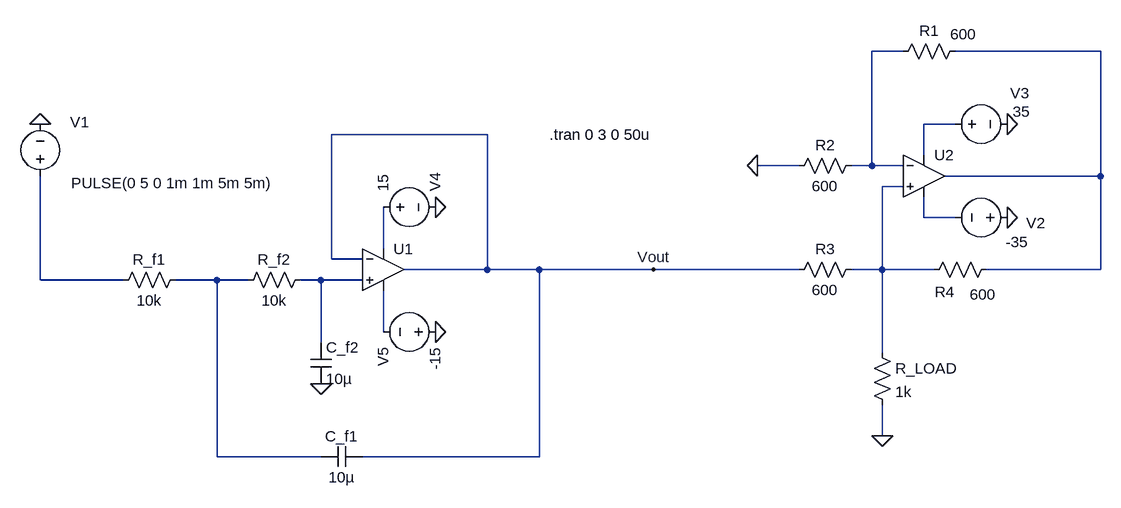
[diagram p0: schematic VCCS_Circuit.asc]
VCCS_Circuit.asc, the LTspice schematic file:
Version 4.1
SHEET 1 1364 680
WIRE 880 -224 832 -224
WIRE 1184 -224 960 -224
WIRE 960 -112 912 -112
WIRE 240 -96 0 -96
WIRE 912 -64 912 -112
WIRE 720 -48 656 -48
WIRE 832 -48 832 -224
WIRE 832 -48 800 -48
WIRE 880 -48 832 -48
WIRE 1184 -32 1184 -224
WIRE 1184 -32 944 -32
WIRE 880 -16 848 -16
WIRE 912 32 912 0
WIRE 960 32 912 32
WIRE 80 80 80 16
WIRE 0 96 0 -96
WIRE 48 96 0 96
WIRE 240 112 240 -96
WIRE 240 112 112 112
WIRE 320 112 240 112
WIRE 496 112 320 112
WIRE 720 112 496 112
WIRE 848 112 848 -16
WIRE 848 112 800 112
WIRE 928 112 848 112
WIRE 1184 112 1184 -32
WIRE 1184 112 1008 112
WIRE -448 128 -448 -32
WIRE -320 128 -448 128
WIRE -176 128 -240 128
WIRE -128 128 -176 128
WIRE -16 128 -48 128
WIRE 48 128 -16 128
WIRE 80 208 80 144
WIRE -16 224 -16 128
WIRE 848 240 848 112
WIRE 848 368 848 320
WIRE -176 400 -176 128
WIRE -16 400 -176 400
WIRE 320 400 320 112
WIRE 320 400 48 400
FLAG -448 -112 0
FLAG 496 112 Vout
FLAG 848 368 0
FLAG 656 -48 0
FLAG 1040 -112 0
FLAG 1040 32 0
FLAG -16 288 0
FLAG 160 16 0
FLAG 160 208 0
SYMBOL voltage -448 -16 R180
WINDOW 123 0 0 Left 0
WINDOW 39 0 0 Left 0
WINDOW 0 -75 99 Left 2
WINDOW 3 -358 5 Left 2
SYMATTR InstName V1
SYMATTR Value PULSE(0 5 0 1m 1m 5m 5m)
SYMBOL res 816 -64 R90
WINDOW 0 0 56 VBottom 2
WINDOW 3 32 56 VTop 2
SYMATTR InstName R2
SYMATTR Value 600
SYMBOL res 816 96 R90
WINDOW 0 0 56 VBottom 2
WINDOW 3 32 56 VTop 2
SYMATTR InstName R3
SYMATTR Value 600
SYMBOL res 1024 96 R90
WINDOW 0 66 80 VBottom 2
WINDOW 3 39 21 VTop 2
SYMATTR InstName R4
SYMATTR Value 600
SYMBOL res 976 -240 R90
WINDOW 0 0 56 VBottom 2
WINDOW 3 -26 3 VTop 2
SYMATTR InstName R1
SYMATTR Value 600
SYMBOL res 832 224 R0
SYMATTR InstName R_LOAD
SYMATTR Value 1k
SYMBOL voltage 1056 32 R90
WINDOW 0 24 -28 VBottom 2
WINDOW 3 22 0 VTop 2
WINDOW 123 0 0 Left 0
WINDOW 39 0 0 Left 0
SYMATTR InstName V2
SYMATTR Value -35
SYMBOL voltage 944 -112 R270
WINDOW 0 32 116 VTop 2
WINDOW 3 35 118 VBottom 2
WINDOW 123 0 0 Left 0
WINDOW 39 0 0 Left 0
SYMATTR InstName V3
SYMATTR Value 35
SYMBOL OpAmps\\UniversalOpAmp 912 -32 R0
SYMATTR InstName U2
SYMATTR SpiceLine En=5 Enk=50 In=0.5 Ink=50 Rin=100Meg
SYMBOL res -224 112 R90
WINDOW 0 0 56 VBottom 2
WINDOW 3 32 56 VTop 2
SYMATTR InstName R_f1
SYMATTR Value 10k
SYMBOL res -32 112 R90
WINDOW 0 0 56 VBottom 2
WINDOW 3 32 56 VTop 2
SYMATTR InstName R_f2
SYMATTR Value 10k
SYMBOL cap -32 224 R0
SYMATTR InstName C_f2
SYMATTR Value 10µ
SYMBOL cap 48 384 R90
WINDOW 0 0 32 VBottom 2
WINDOW 3 32 32 VTop 2
SYMATTR InstName C_f1
SYMATTR Value 10µ
SYMBOL voltage 64 16 R270
WINDOW 0 24 96 Left 2
WINDOW 3 24 16 Left 2
WINDOW 123 0 0 Left 0
WINDOW 39 0 0 Left 0
SYMATTR InstName V4
SYMATTR Value 15
SYMBOL voltage 176 208 R90
WINDOW 0 24 96 Left 2
WINDOW 3 24 16 Left 2
WINDOW 123 0 0 Left 0
WINDOW 39 0 0 Left 0
SYMATTR InstName V5
SYMATTR Value -15
SYMBOL OpAmps\\UniversalOpAmp 80 112 R0
SYMATTR InstName U1
TEXT 336 -96 Left 2 !.tran 0 3 0 50u

The netlist it stands for:
* VCCS_Circuit.asc
V1 N007 0 PULSE(0 5 0 1m 1m 5m 5m)
R2 N001 0 600
R3 N004 Vout 600
R4 N002 N004 600
R1 N002 N001 600
R_LOAD N004 0 1k
V2 0 N005 -35
V3 N003 0 35
X§U2 N004 N001 N003 N005 N002 level1 Avol=1Meg GBW=10Meg Vos=0 En=5 Enk=50 In=0.5 Ink=50 Rin=100Meg  ; pins In+ In- V+ V- OUT
R_f1 N008 N007 10k
R_f2 N009 N008 10k
C_f2 N009 0 10µ
C_f1 Vout N008 10µ
V4 N006 0 15
V5 0 N010 -15
X§U1 N009 Vout N006 N010 Vout level1 Avol=1Meg GBW=10Meg Vos=0 En=0 Enk=0 In=0 Ink=0 Rin=500Meg  ; pins In+ In- V+ V- OUT
.tran 0 3 0 50u
.lib UniversalOpAmp1.lib
.backanno
.end